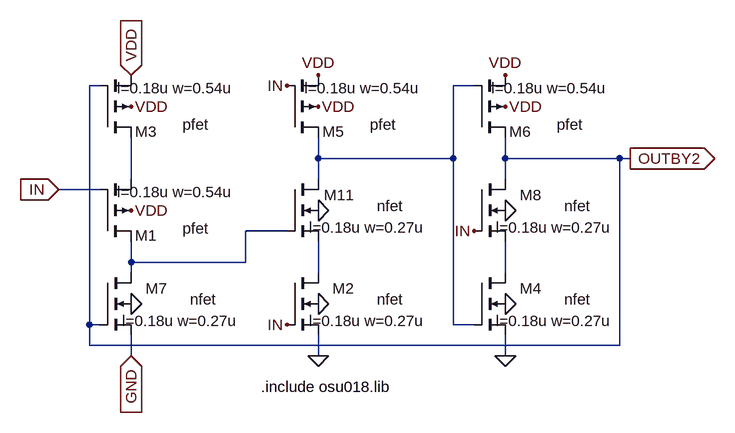
[diagram p0: schematic Z_DIV2.asc]
Z_DIV2.asc, the LTspice schematic file:
Version 4
SHEET 1 6288 680
WIRE 1120 -496 1104 -496
WIRE 1696 -496 1664 -496
WIRE 1456 -384 1456 -416
WIRE 1664 -384 1664 -496
WIRE 1664 -384 1456 -384
WIRE 1744 -384 1744 -416
WIRE 1920 -384 1744 -384
WIRE 1936 -384 1920 -384
WIRE 1168 -352 1168 -416
WIRE 1456 -352 1456 -384
WIRE 1744 -352 1744 -384
WIRE 1120 -336 1056 -336
WIRE 1408 -272 1344 -272
WIRE 1168 -224 1168 -256
WIRE 1344 -224 1344 -272
WIRE 1344 -224 1168 -224
WIRE 1168 -208 1168 -224
WIRE 1456 -208 1456 -256
WIRE 1744 -208 1744 -256
WIRE 1104 -128 1104 -496
WIRE 1120 -128 1104 -128
WIRE 1664 -128 1664 -384
WIRE 1696 -128 1664 -128
WIRE 1104 -96 1104 -128
WIRE 1920 -96 1920 -384
WIRE 1920 -96 1104 -96
WIRE 1168 -80 1168 -112
WIRE 1456 -80 1456 -112
WIRE 1744 -80 1744 -112
FLAG 1168 -464 VDD
FLAG 1456 -80 0
FLAG 1456 -464 VDD
FLAG 1168 -304 VDD
FLAG 1456 -304 0
FLAG 1456 -160 0
FLAG 1168 -160 0
FLAG 1456 -512 VDD
FLAG 1168 -512 VDD
IOPIN 1168 -512 In
FLAG 1168 -80 GND
IOPIN 1168 -80 In
FLAG 1744 -80 0
FLAG 1744 -464 VDD
FLAG 1744 -304 0
FLAG 1744 -160 0
FLAG 1744 -512 VDD
FLAG 1936 -384 OUTBY2
IOPIN 1936 -384 Out
FLAG 1056 -336 IN
IOPIN 1056 -336 In
FLAG 1408 -496 IN
FLAG 1408 -128 IN
FLAG 1696 -272 IN
SYMBOL pmos4 1120 -416 M180
WINDOW 0 88 9 Right 2
WINDOW 3 168 20 Right 2
WINDOW 123 206 76 Right 2
SYMATTR InstName M3
SYMATTR Value pfet
SYMATTR Value2 l=0.18u w=0.54u
SYMBOL nmos4 1408 -352 R0
WINDOW 0 104 24 Right 2
WINDOW 3 179 41 Right 2
WINDOW 123 213 74 Right 2
SYMATTR InstName M11
SYMATTR Value nfet
SYMATTR Value2 l=0.18u w=0.27u
SYMBOL pmos4 1120 -256 M180
WINDOW 0 88 9 Right 2
WINDOW 3 168 20 Right 2
WINDOW 123 206 76 Right 2
SYMATTR InstName M1
SYMATTR Value pfet
SYMATTR Value2 l=0.18u w=0.54u
SYMBOL pmos4 1408 -416 M180
WINDOW 0 88 9 Right 2
WINDOW 3 168 20 Right 2
WINDOW 123 206 76 Right 2
SYMATTR InstName M5
SYMATTR Value pfet
SYMATTR Value2 l=0.18u w=0.54u
SYMBOL pmos4 1696 -416 M180
WINDOW 0 88 9 Right 2
WINDOW 3 168 20 Right 2
WINDOW 123 206 76 Right 2
SYMATTR InstName M6
SYMATTR Value pfet
SYMATTR Value2 l=0.18u w=0.54u
SYMBOL nmos4 1120 -208 R0
WINDOW 0 104 24 Right 2
WINDOW 3 179 41 Right 2
WINDOW 123 213 74 Right 2
SYMATTR InstName M7
SYMATTR Value nfet
SYMATTR Value2 l=0.18u w=0.27u
SYMBOL nmos4 1408 -208 R0
WINDOW 0 104 24 Right 2
WINDOW 3 179 41 Right 2
WINDOW 123 213 74 Right 2
SYMATTR InstName M2
SYMATTR Value nfet
SYMATTR Value2 l=0.18u w=0.27u
SYMBOL nmos4 1696 -208 R0
WINDOW 0 104 24 Right 2
WINDOW 3 179 41 Right 2
WINDOW 123 213 74 Right 2
SYMATTR InstName M4
SYMATTR Value nfet
SYMATTR Value2 l=0.18u w=0.27u
SYMBOL nmos4 1696 -352 R0
WINDOW 0 104 24 Right 2
WINDOW 3 179 41 Right 2
WINDOW 123 213 74 Right 2
SYMATTR InstName M8
SYMATTR Value nfet
SYMATTR Value2 l=0.18u w=0.27u
TEXT 1368 -32 Left 2 !.include osu018.lib

The netlist it stands for:
* Z_DIV2.asc
M3 N002 OUTBY2 VDD VDD pfet l=0.18u w=0.54u
M11 N001 N003 N004 0 nfet l=0.18u w=0.27u
M1 N003 IN N002 VDD pfet l=0.18u w=0.54u
M5 N001 IN VDD VDD pfet l=0.18u w=0.54u
M6 OUTBY2 N001 VDD VDD pfet l=0.18u w=0.54u
M7 N003 OUTBY2 GND 0 nfet l=0.18u w=0.27u
M2 N004 IN 0 0 nfet l=0.18u w=0.27u
M4 N005 N001 0 0 nfet l=0.18u w=0.27u
M8 OUTBY2 IN N005 0 nfet l=0.18u w=0.27u
.model NMOS NMOS
.model PMOS PMOS
.lib standard.mos
.include osu018.lib
.backanno
.end